# Altium schematic sheet atmega.SchDoc
size A3; SheetNumber: 1; SheetTotal: 2
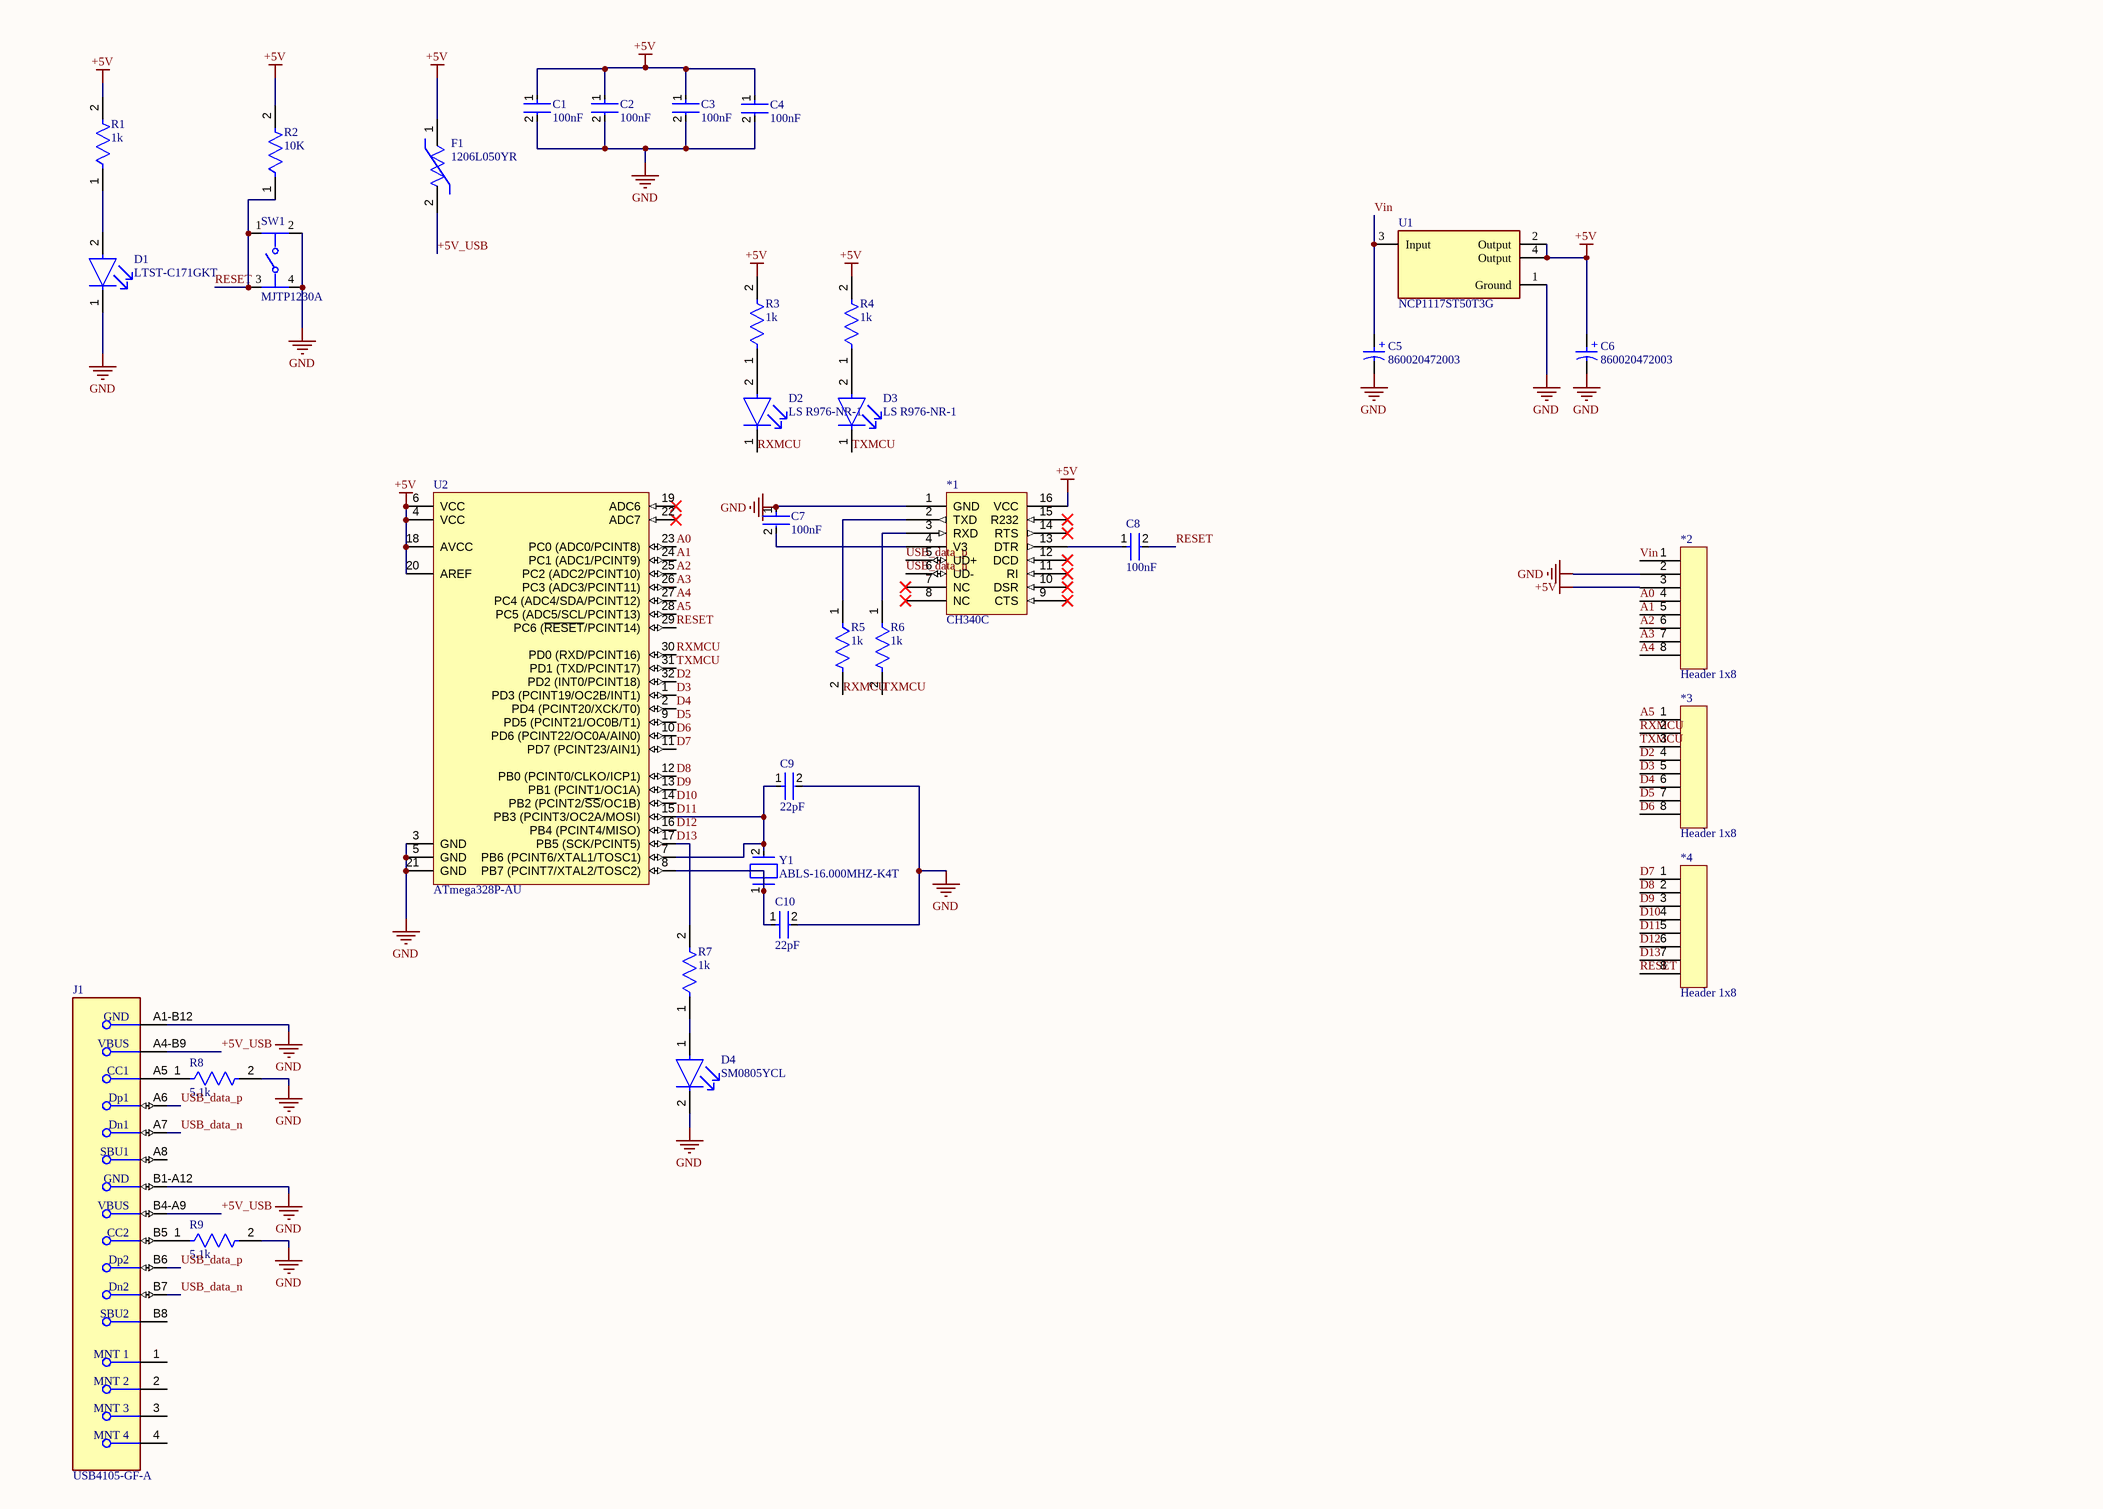
[diagram p0: atmega.SchDoc]

## Parts
*1  CH340C  [SOP16]
*2  Header 1x8  [Header2.54mm1x8]
*3  Header 1x8  [Header2.54mm1x8]
*4  Header 1x8  [Header2.54mm1x8]
C1  100nF  [FP-CC0805-0_85-MFG]
C2  100nF  [FP-CC0805-0_85-MFG]
C3  100nF  [FP-CC0805-0_85-MFG]
C4  100nF  [FP-CC0805-0_85-MFG]
C5  860020472003  [WCAP-ATG5_D5H11]
C6  860020472003  [WCAP-ATG5_D5H11]
C7  100nF  [FP-CC0805-0_85-MFG]
C8  100nF  [FP-CC0805-0_85-MFG]
C9  22pF  [FP-C0805C-DN-MFG]
C10  22pF  [FP-C0805C-DN-MFG]
D1  LTST-C171GKT  [FP-LTST-C171GKT-MFG]
D2  LS R976-NR-1  [FP-LS_R976-MFG]
D3  LS R976-NR-1  [FP-LS_R976-MFG]
D4  SM0805YCL  [FP-SM0805YCL-MFG]
F1  1206L050YR  [FP-1206L050YR-MFG]
J1  USB4105-GF-A  [FP-USB4105-GF-A-MFG]
R1  1k  [FP-RN73R2A-IPC_A]
R2  10K  [FP-RN73R2A-IPC_A]
R3  1k  [FP-RN73R2A-IPC_A]
R4  1k  [FP-RN73R2A-IPC_A]
R5  1k  [FP-RN73R2A-IPC_A]
R6  1k  [FP-RN73R2A-IPC_A]
R7  1k  [FP-RN73R2A-IPC_A]
R8  5.1k  [FP-MCU0805-IPC_A]
R9  5.1k  [FP-MCU0805-IPC_A]
SW1  MJTP1230A  [FP-MJTP1230A-MFG]
U1  NCP1117ST50T3G  [FP-318H-MFG]
U2  ATmega328P-AU  [32A_M]
Y1  ABLS-16.000MHZ-K4T  [FP-ABLS-MFG]

## Nets
+5V: *1.16(VCC) *2.3 C1.1 C2.1 C3.1 C4.1 C6.1(P) F1.1 R1.2 R2.2 R3.2 R4.2 U1.2(Output) U1.4(Output) U2.4(VCC) U2.6(VCC) U2.18(AVCC) U2.20(AREF)
GND: *1.1(GND) *2.2 C1.2 C2.2 C3.2 C4.2 C5.2(N) C6.2(N) C7.1 C9.2 C10.2 D1.1(C) D4.2(C) J1.A1-B12(GND) J1.B1-A12(GND) R8.2 R9.2 SW1.2 SW1.4 U1.1(Ground) U2.3(GND) U2.5(GND) U2.21(GND)
+5V_USB: F1.2 J1.A4-B9(VBUS) J1.B4-A9(VBUS)
A0: *2.4 U2.23(PC0_(ADC0/PCINT8))
A1: *2.5 U2.24(PC1_(ADC1/PCINT9))
A2: *2.6 U2.25(PC2_(ADC2/PCINT10))
A3: *2.7 U2.26(PC3_(ADC3/PCINT11))
A4: *2.8 U2.27(PC4_(ADC4/SDA/PCINT12))
A5: *3.1 U2.28(PC5_(ADC5/SCL/PCINT13))
D2: *3.4 U2.32(PD2_(INT0/PCINT18))
D3: *3.5 U2.1(PD3_(PCINT19/OC2B/INT1))
D4: *3.6 U2.2(PD4_(PCINT20/XCK/T0))
D5: *3.7 U2.9(PD5_(PCINT21/OC0B/T1))
D6: *3.8 U2.10(PD6_(PCINT22/OC0A/AIN0))
D7: *4.1 U2.11(PD7_(PCINT23/AIN1))
D8: *4.2 U2.12(PB0_(PCINT0/CLKO/ICP1))
D9: *4.3 U2.13(PB1_(PCINT1/OC1A))
D10: *4.4 U2.14(PB2_(PCINT2/~{SS}/OC1B))
D11: *4.5 C9.1 U2.7(PB6_(PCINT6/XTAL1/TOSC1)) U2.15(PB3_(PCINT3/OC2A/MOSI)) Y1.2
D12: *4.6 U2.16(PB4_(PCINT4/MISO))
D13: *4.7 R7.2 U2.17(PB5_(SCK/PCINT5))
RESET: *4.8 C8.2 R2.1 SW1.1 SW1.3 U2.29(PC6_(~{RESET}/PCINT14))
RXMCU: *3.2 D2.1(C) R5.2 U2.30(PD0_(RXD/PCINT16))
TXMCU: *3.3 D3.1(C) R6.2 U2.31(PD1_(TXD/PCINT17))
USB_data_n: *1.6(UD-) J1.A7(Dn1) J1.B7(Dn2)
USB_data_p: *1.5(UD+) J1.A6(Dp1) J1.B6(Dp2)
Vin: *2.1 C5.1(P) U1.3(Input)
Net*1_2: *1.2(TXD) R5.1
Net*1_3: *1.3(RXD) R6.1
Net*1_4: *1.4(V3) C7.2
Net*1_13: *1.13(DTR) C8.1
NetC10_1: C10.1 U2.8(PB7_(PCINT7/XTAL2/TOSC2)) Y1.1
NetD1_2: D1.2(A) R1.1
NetD2_2: D2.2(A) R3.1
NetD3_2: D3.2(A) R4.1
NetD4_1: D4.1(A) R7.1
NetJ1_A5: J1.A5(CC1) R8.1
NetJ1_B5: J1.B5(CC2) R9.1

Not connected (* = marked no-connect by the designer): *1 7(NC)* 8(NC)* 9(CTS)* 10(DSR)* 11(RI)* 12(DCD)* 14(RTS)* 15(R232)*; J1 1(MNT_1) 2(MNT_2) 3(MNT_3) 4(MNT_4) A8(SBU1) B8(SBU2); U2 19(ADC6)* 22(ADC7)*

## Notes on the sheet
- THIS DOCUMENT AND THE DATA DISCLOSED HEREIN OR
- HEREWITH IS THE PROPERTY OF ALTIUM LIMITED AND MAY
- DWG NO:
- REVISION
- REV:
- DESCRIPTION
- DATE
- APPROVED
- BE FREELY DISTRIBUTED IN WHOLE. NO RIGHTS ARE
- RESERVED OR EXPRESS OR IMPLIED WARANTEE GIVEN.
- ENG:
- APPROVALS
- PROJECT
- DSN:
- CHK:
- REFERENCE DOCUMENTS
- PROJECT REVISION:
- TITLE
- DOCUMENT REVISION:
- DESIGN ITEM:
- BOM:
- FAB DWG:
- PCB DWG:
- ASSY DWG:
- SCALE:
- A3
- SIZE
- CAGE CODE
- FILE NAME
- DWG NO.
- SHEET
- OF
- REV
- (in symbol CMP-03913-53914185-1) +

## Library data of the parts
C1-C4 C7 C8 = CMP-2100-03606-3: CAP CER 0.1UF 50V X7R 0805; Manufacturer Part Number: CC0805KRX7R9BB104; Manufacturer: Yageo; Tolerance: 0.1; Description: CC0805 100 nF X7R 10.00% 50 V; Material: Ceramic; Device Class L1: Passive Components; ComponentLink2Description: Datasheet; Package: CC0805-0.85; Digikey Description: CAP CER 0.1UF 50V X7R 0805; Capacitance: 100 nF; Device Class L3: Ceramic Capacitors; Value: 100 nF; Temperature: -30°C to +85°C; Temperature Characteristic: X7R; Voltage Rating: 50 V; Height: 0.95mm; RoHS: TRUE; Ipc Land Pattern Name: CAPC200125X85; Device Class L2: Capacitors; Category: Cap; Temperature Range Low: -30°C; Temperature Range High: +85°C; Mouser Description: Multilayer Ceramic Capacitors MLCC - SMD/SMT 100nF 50V X7R 10%; Footprint Url: http://www.yageo.com/exep/pages/download/literatures/UPY-C_GEN_24.pdf; Automotive: No; Octopart: https://octopart.com/cc0805krx7r9bb104-yageo-192993; Lead Free: Yes; ComponentLink2URL: http://www.yageo.com/documents/recent/UPY-GPHC_Y5V_6.3V-to-50V_8.pdf
C5 C6 = CMP-03913-53914185-1: 860020472003 WCAP-ATG5 Aluminum Electrolytic Capacitors; Leakage Current: 3µA; Tolerance: 20%; Ripple Current: 38mA; Polarity: Polar; Voltage Rating: 25V; Pitch: 2mm; Capacitance: 10µF; Life (Hours): 2000hours; NexarPartId: 53914185; Min Operating Temperature: -40°C; Length: 11mm; Lead Pitch: 2.0066mm; Mount: Through Hole; Case/Package: Radial; RoHS: Compliant; Max Operating Temperature: 105°C; Diameter: 5mm; Packaging: Tape & Box (TB); Height - Seated (Max): 12.4968mm
C9 C10 = CMP-03020-019421-1: CAP CER SMD 0805 22PF 10% 50V X7; Manufacturer: KEMET; Manufacturer Part Number: C0805C220K5RACAUTO; Tolerance: 0.1; Description: C0805 22 pF X7R 30ppm/°C 10.00% 50 V; Temperature Characteristic: X7R; Material: Ceramic; Temperature Coefficient: 30ppm/°C; Ipc Land Pattern Name: CAPC200125X78; Package: C0805C-DN; Category: Cap; Device Class L1: Passive Components; Device Class L2: Capacitors; Octopart: https://octopart.com/c0805c220k5racauto-kemet-86504565; Lead Free: Yes; Height: 0.88mm; Temperature Range Low: -55°C; ComponentLink2Description: Datasheet; Mouser Description: Cap Ceramic 22pF 50V X7R 10% SMD 0805 125°C Paper T/R; Capacitance: 22 pF; Value: 22 pF; RoHS: TRUE; Temperature: -55°C to +125°C; Voltage Rating: 50 V; Digikey Description: CAP CER SMD 0805 22PF 10% 50V X7; Device Class L3: Ceramic Capacitors; Automotive: No; ComponentLink2URL: https://content.kemet.com/datasheets/KEM_C1003_C0G_SMD.pdf; Temperature Range High: +125°C
D1 = CMP-22017-000007-1: LED GREEN CLEAR CHIP SMD; Luminous Intensity: 12mcd; Lens Color: Colorless; Dominant Wavelength: 569nm; Number of LEDs: 1; Power Dissipation: 100mW; Viewing Angle: 130°; Reverse Voltage: 5V; Test Current: 10mA; Forward Voltage: 2.1V; Wavelength: 585nm; Lens Style: Diffused; Forward Current: 30mA; Height: 0.8mm; Mount: Surface Mount; Package Quantity: 1; Length: 2mm; Case Code (Metric): 2012; Number of Pins: 2; Number of Elements: 1; Packaging: Tape and Reel; Color: Green; Min Operating Temperature: -55°C; Case/Package: 0805; Power Rating: 100mW; Max Operating Temperature: 85°C; Radiation Hardening: No; Depth: 1.25mm; Lens Transparency: Clear; Width: 1.25mm; Lead Free: Lead Free; Case Code (Imperial): 0805; Illumination Color: Green
D2 D3 = CMP-62016-000037-1: LED RED DIFFUSED 0805 SMD; Lens Size: 1.25mm; Number of LEDs: 1; Luminous Intensity: 180mcd; Dominant Wavelength: 633nm; Lens Style: Flat; Reverse Voltage: 12V; Lens Color: White; Forward Voltage: 2.5V; Forward Current: 25mA; Power Dissipation: 65W; Luminous Flux: 0.47lm; Test Current: 20mA; Viewing Angle: 160°; Length: 2mm; Number of Pins: 2; Lens Transparency: Diffused; Min Operating Temperature: -30°C; Case Code (Metric): 2012; Depth: 1.35mm; Color: Red; Illumination Color: Red; Max Operating Temperature: 85°C; Mount: Surface Mount; Case/Package: 0805; Height: 0.9mm; Package Quantity: 16000; Number of Elements: 1; Radiation Hardening: No; Case Code (Imperial): 0805; Packaging: Tape and Reel; Width: 1.25mm
D4 = CMP-35283-000007-1: LED YELLOW CLEAR 0805 SMD; Luminous Intensity: 11.5mcd; Test Current: 2mA; Viewing Angle: 130°; Dominant Wavelength: 592nm; Forward Voltage: 1.9V; Lens Color: Colorless; Case Code (Metric): 2012; Illumination Color: Yellow; Length: 2mm; Max Operating Temperature: 80°C; Width: 1.2mm; Case Code (Imperial): 0805; Packaging: Tape and Reel; Lens Transparency: Clear; Mount: Surface Mount; Case/Package: 0805; Forward Current: 2mA; Height: 0.8mm; Lead Free: Lead Free; Min Operating Temperature: -30°C; Color: Yellow; Package Quantity: 4000
F1 = CMP-08606-000073-1: PTC RESET FUSE 6V 500MA 1206; Trip Current: 1A; Current Rating: 100A; Resistance: 700mR; Approvals: cULus; Max Power Dissipation: 600mW; Time to Trip: 0.1s; Hold Current: 500mA; Min Operating Temperature: -40°C; Voltage Rating (DC): 6V; Working Voltage: 6V; Package Quantity: 4000; Termination: SMD/SMT; Lead Free: Lead Free; REACH SVHC: No SVHC; Series: 1206L; Max Voltage Rating (DC): 6V; Height: 0.75mm; Terminal Material: Copper; Packaging: Tape and Reel; Case Code (Imperial): 1206; Length: 3.4mm; RoHS Compliant: Yes; Operating Supply Voltage: 6V; Case Code (Metric): 3216; Width: 1.8mm; Max Current Rating: 100A; Case/Package: 1206; Power Dissipation: 600mW; Max Operating Temperature: 85°C; Voltage Rating: 6V
J1 = CMP-245163-000001-1: CONN RCPT USB2.0 TYPEC 5A; Manufacturer: GCT; Description: USB - C (Type - C) USB 2.0 Receptacle Connector 24 Position Surface Mount, Right Angle; Through Hole; Voltage Rating: 20V; Is Female: yes; Current Rating: 5/6.25/1.25/0.25A; Number Of Contacts: 16; Conn Orientation: Right Angle; Device Class L1: Connectors; Category: Conn; Lead Free: Yes; RoHS: TRUE; Temperature Range High: +85°C; Digikey Description: CONN RCPT USB2.0 TYPEC 5A; Device Class L3: unset; ComponentLink2Description: Datasheet; Manufacturer Part Number: USB4105-GF-A; Package: 0; Usb Standard: USB 2.0; Device Class L2: USB Connectors; Automotive: No; Temperature Range Low: -40°C; Height: 3.46mm; Temperature: -40°C to +85°C; Contact Material: Gold,Nickel; ComponentLink2URL: https://gct.co/files/drawings/usb4105.pdf; Octopart: https://octopart.com/usb4105-gf-a-gct-106627878
R1 R3-R7 = CMP-04015-026717-1: 1kΩ ±0.1% 0.125W, 1/8W Chip Resistor 0805 (2012 Metric) Moisture Resistant Thin Film
R2 = CMP-04015-052084-1: RES 10K OHM 0.1% 1/8W 0805
R8 R9 = CMP-02407-002872-1: RES 1.05K OHM 0.5% 1/5W 0805
SW1 = CMP-47024-000004-1: SWITCH TACTILE SPST-NO 0.05A 12V; Mechanical Life: 100000Cycles; Throw Configuration: SPST; Actuator Length: 1.4mm; Switch Travel: 0.25mm; Actuator Color: Black; Operating Force: 160gf; Contact Resistance: 100mR; Actuator Type: Standard; Switch Function: Off-Mom; Actuator Material: Thermoplastic; Illumination Type: Non-Illuminated; Current Rating: 50mA; Min Operating Temperature: -20°C; Series: MJTP; Electrical Life: 100000Cycles; Mount: Through Hole; Packaging: Bulk; Color: Black; Package Quantity: 2000; Voltage Rating (DC): 12V; REACH SVHC: No SVHC; Orientation: Straight; Termination: PC Pin; Contact Material: Bronze; RoHS Compliant: Yes; Max Voltage Rating (DC): 12V; Max Operating Temperature: 70°C; Contact Plating: Silver
U1 = CMP-0592-00001-4: IC REG LINEAR 5V 1A SOT223; Output Voltage Accuracy: 1%; Number of Outputs: 1; Dropout Voltage: 1.2V; Polarity: Positive; Power Rating: 781mW; Input Bias Current: 6mA; Quiescent Current: 10mA; Output Type: Fixed; Max Input Voltage: 20V; Min Input Voltage: 3.5V; Max Operating Temperature: 125°C; Number of Pins: 4; Case/Package: SOT-223; Min Operating Temperature: 0°C; Accuracy: 1%; Contact Plating: Tin; Min Current Limit: 1A; Output Current: 1A; Max Output Current: 1A; Length: 6.7mm; Packaging: Tape and Reel; Package Quantity: 1; Height: 1.69mm; REACH SVHC: No SVHC; Width: 3.7mm; Halogen Free: Halogen Free; RoHS Compliant: Yes; Nominal Output Voltage: 5V; Lead Free: Lead Free; Radiation Hardening: No; Tolerance: 1%; Number of Regulators: 1; Output Voltage: 5V
U2 = CMP-0095-00269-2: 8-bit AVR Microcontroller, 32KB Flash, 1KB EEPROM, 2KB SRAM, 32-pin TQFP, Industrial Grade (-40°C to 85°C); PackageDescription: 32-Lead, 7x7x1.0 mm Body, 0.8mm Lead Pitch, Thin Profile Plastic Quad Flat Package (TQFP); DatasheetVersion: revD, May-2011; RevisionNote: DatasheetVersion & PackageVersion updated. URLs added.; ComponentLink1URL: http://www.atmel.com/; ComponentLink2Description: ATmega48A/48PA/88A/88PA/168A/168PA/328/328P Datasheet; Code_JEDEC: MS-026-ABA; ComponentLink1Description: Manufacturer URL; PackageReference: 32A; ComponentLink3Description: ATmega48A/48PA/88A/88PA/168A/168PA/328/328P Summary; ComponentLink2URL: http://www.atmel.com/dyn/resources/prod_documents/doc8271.pdf; PackageVersion: revC, Oct-2010; ComponentLink3URL: http://www.atmel.com/dyn/resources/prod_documents/8271S.pdf
Y1 = CMP-27762-000003-1: CRYSTAL 16.0000MHZ 18PF SMD; Manufacturer: Abracon; Frequency: 16MHz; Stability: 50ppm; Tolerance: 30ppm; Description: 16MHz ±30ppm Crystal 18pF 40 Ohms HC-49/US; Standoff Height: 0mm; Esr: 40Ω; ComponentLink2URL: https://abracon.com/Resonators/abls.pdf; Temperature Range High: +125°C; Package: ABLS; Device Class L3: Crystals; Temperature: -40°C to +125°C; Load Capacitance: 18pF; Device Class L2: Crystals / Oscillators; Mouser Description: Crystal 16MHz ±30ppm (Tol) ±50ppm (Stability) 18pF FUND 40Ohm 2-Pin HC-49/US SMD T/R; Category: Crys; ComponentLink2Description: Datasheet; Manufacturer Part Number: ABLS-16.000MHZ-K4T; Series: ABLS; Automotive: No; Octopart: https://octopart.com/abls-16.000mhz-k4t-abracon-18618626; RoHS: TRUE; Digikey Description: CRYSTAL 16.0000MHZ 18PF SMD; Temperature Range Low: -40°C; Lead Free: Yes; Height: 4.3mm; Device Class L1: Passive Components